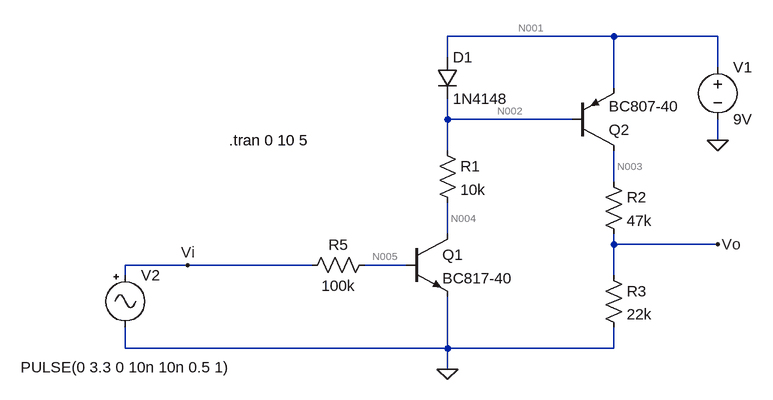
[diagram p0: schematic Sensor de tension.asc]
Sensor de tension.asc, the LTspice schematic file:
Version 4
SHEET 1 880 680
WIRE 336 -32 80 -32
WIRE 496 -32 336 -32
WIRE 80 0 80 -32
WIRE 496 16 496 -32
WIRE 336 48 336 -32
WIRE 80 96 80 64
WIRE 272 96 80 96
WIRE 496 128 496 96
WIRE 80 144 80 96
WIRE 336 192 336 144
WIRE 80 272 80 224
WIRE 336 288 336 272
WIRE 496 288 336 288
WIRE -320 320 -416 320
WIRE -128 320 -320 320
WIRE 16 320 -48 320
WIRE -416 336 -416 320
WIRE 336 336 336 288
WIRE -416 448 -416 416
WIRE 80 448 80 368
WIRE 80 448 -416 448
WIRE 336 448 336 416
WIRE 336 448 80 448
WIRE 80 480 80 448
FLAG 496 128 0
FLAG 80 480 0
FLAG 496 288 Vo
FLAG -320 320 Vi
SYMBOL res 64 128 R0
SYMATTR InstName R1
SYMATTR Value 10k
SYMBOL res 320 176 R0
SYMATTR InstName R2
SYMATTR Value 47k
SYMBOL res 320 320 R0
SYMATTR InstName R3
SYMATTR Value 22k
SYMBOL npn 16 272 R0
SYMATTR InstName Q1
SYMATTR Value BC817-40
SYMBOL pnp 272 144 M180
SYMATTR InstName Q2
SYMATTR Value BC807-40
SYMBOL res -32 304 R90
WINDOW 0 0 56 VBottom 2
WINDOW 3 32 56 VTop 2
SYMATTR InstName R5
SYMATTR Value 100k
SYMBOL diode 64 0 R0
SYMATTR InstName D1
SYMATTR Value 1N4148
SYMBOL voltage 496 0 R0
SYMATTR InstName V1
SYMATTR Value 9V
SYMBOL Misc\\signal -416 320 R0
WINDOW 3 -161 157 Left 2
WINDOW 123 0 0 Left 0
WINDOW 39 0 0 Left 0
SYMATTR Value PULSE(0 3.3 0 10n 10n 0.5 1)
SYMATTR InstName V2
TEXT -256 128 Left 2 !.tran 0 10 5

The netlist it stands for:
* Sensor de tension.asc
R1 N002 N004 10k
R2 N003 Vo 47k
R3 Vo 0 22k
Q1 N004 N005 0 0 BC817-40
Q2 N003 N002 N001 0 BC807-40
R5 N005 Vi 100k
D1 N001 N002 1N4148
V1 N001 0 9V
V2 Vi 0 PULSE(0 3.3 0 10n 10n 0.5 1)
.model D D
.lib standard.dio
.model NPN NPN
.model PNP PNP
.lib standard.bjt
.tran 0 10 5
.backanno
.end

* Results of the author's LTspice run, read from the files saved beside the schematic
* Operating Point, zero values left out:
*   V(n002) = 8.767 V
*   V(n004) = 8.767 V
*   V(n003) = 142.4 µV
*   V(vo) = 45.41 µV
*   V(n005) = 895.8 nV
*   V(n001) = 9 V
*   Ic(Q2) = -2.064 nA
*   Ib(Q2) = -9.026 pA
*   Ie(Q2) = 2.073 nA
*   Ic(Q1) = 9.043 pA
*   Ib(Q1) = -8.958 pA
*   I(R5) = 8.958 pA
*   I(R3) = 2.064 nA
*   I(R2) = 2.064 nA
*   I(R1) = 9.026 pA
*   I(V2) = 8.958 pA
*   I(V1) = -2.073 nA
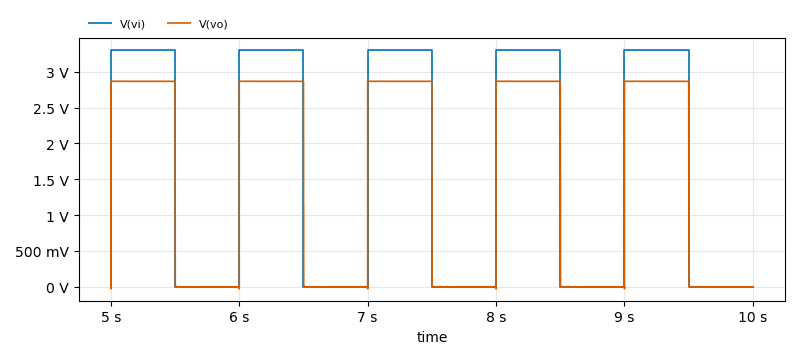
[diagram p1: Transient Analysis of Sensor de tension.asc, plotted from the saved traces]
* Transient Analysis, 1 run:
*   V(vi): min 0 V, max 3.3 V, average 1.65 V, rms 2.333 V, last 0 V
*   V(vo): min -28.38 mV, max 2.868 V, average 1.435 V, rms 2.029 V, last 46.35 µV